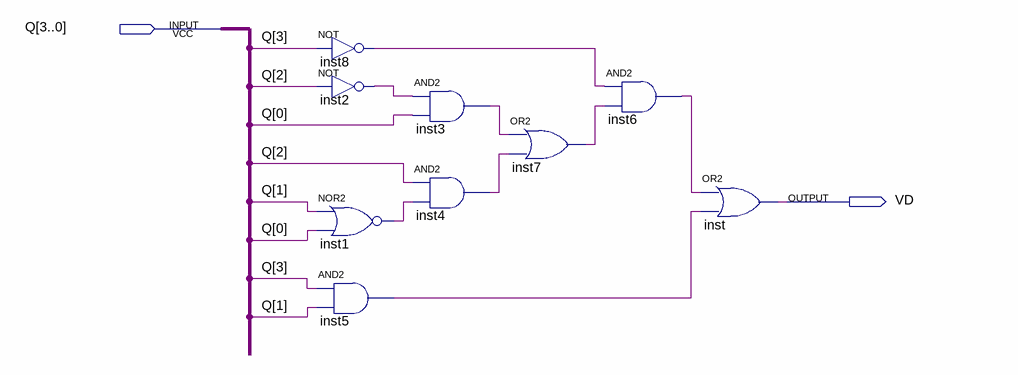
[diagram p0: schematic sheet]
// Quartus schematic VerdeDerecha.bdf as structural Verilog: 9 symbols, 2 pins
module VerdeDerecha (
  input  [3:0] Q,
  output VD
);

  wire inst1_out, inst2_out, inst3_out, inst4_out, inst5_out, inst6_out, inst7_out, inst8_out;

  not inst8 (inst8_out, Q[3]);
  not inst2 (inst2_out, Q[2]);
  nor inst1 (inst1_out, Q[1], Q[0]);
  and inst5 (inst5_out, Q[3], Q[1]);
  and inst3 (inst3_out, inst2_out, Q[0]);
  and inst4 (inst4_out, Q[2], inst1_out);
  or inst7 (inst7_out, inst3_out, inst4_out);
  and inst6 (inst6_out, inst8_out, inst7_out);
  or inst (VD, inst6_out, inst5_out);
endmodule
